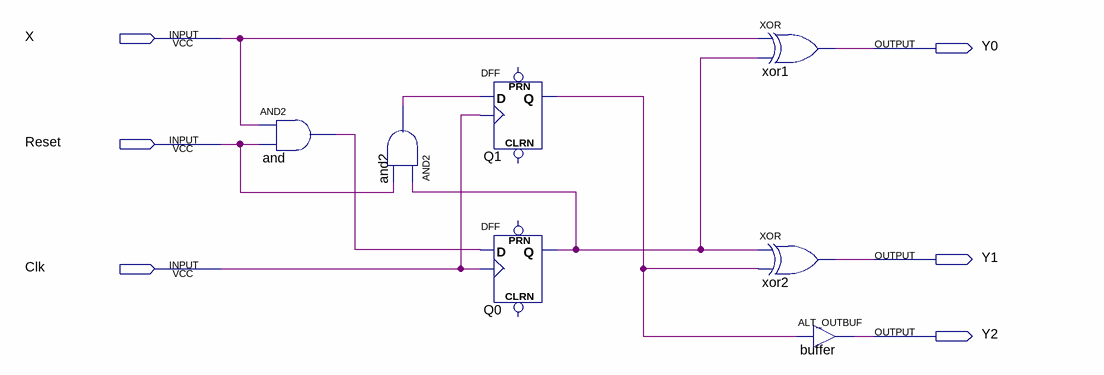
[diagram p0: schematic sheet]
// Quartus schematic Bin2Gray.bdf as structural Verilog: 7 symbols, 6 pins
module Bin2Gray (
  input  X,
  input  Reset,
  input  Clk,
  output Y0,
  output Y1,
  output Y2
);

  wire and2_out, and_out, Q0_q, Q1_q;

  and \and  (and_out, X, Reset);
  and and2 (and2_out, Q0_q, Reset);
  DFF Q1 (.CLK(Clk), .D(and2_out), .Q(Q1_q));  // open: CLRN, PRN
  DFF Q0 (.CLK(Clk), .D(and_out), .Q(Q0_q));  // open: CLRN, PRN
  xor xor1 (Y0, X, Q0_q);
  xor xor2 (Y1, Q0_q, Q1_q);
  ALT_OUTBUF buffer (.i(Q1_q), .o(Y2));
endmodule
